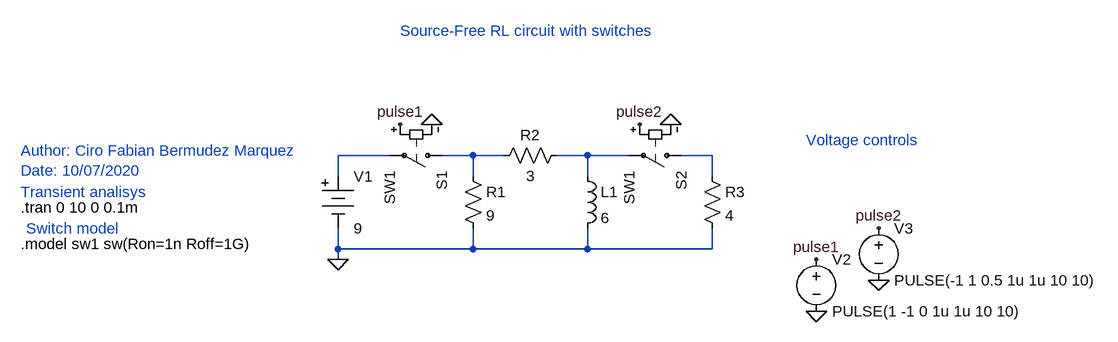
[diagram p0: schematic source_free_RL_with_switches.asc]
source_free_RL_with_switches.asc, the LTspice schematic file:
Version 4
SHEET 1 1204 680
WIRE -96 224 -176 224
WIRE 32 224 -16 224
WIRE 80 224 32 224
WIRE 208 224 160 224
WIRE 272 224 208 224
WIRE 400 224 352 224
WIRE -176 256 -176 224
WIRE 32 256 32 224
WIRE 208 256 208 224
WIRE 400 256 400 224
WIRE -176 368 -176 336
WIRE 32 368 32 336
WIRE 32 368 -176 368
WIRE 208 368 208 336
WIRE 208 368 32 368
WIRE 400 368 400 336
WIRE 400 368 208 368
WIRE -176 384 -176 368
FLAG -176 384 0
FLAG 560 464 0
FLAG 560 384 pulse1
FLAG -32 176 0
FLAG -80 176 pulse1
FLAG 336 176 0
FLAG 656 416 0
FLAG 656 336 pulse2
FLAG 288 176 pulse2
SYMBOL Misc\\battery -176 240 R0
WINDOW 123 0 0 Left 0
WINDOW 39 0 0 Left 0
SYMATTR InstName V1
SYMATTR Value 9
SYMBOL res 64 240 R270
WINDOW 0 32 56 VTop 2
WINDOW 3 0 56 VBottom 2
SYMATTR InstName R2
SYMATTR Value 3
SYMBOL res 16 240 R0
SYMATTR InstName R1
SYMATTR Value 9
SYMBOL res 384 240 R0
SYMATTR InstName R3
SYMATTR Value 4
SYMBOL ind 192 240 R0
SYMATTR InstName L1
SYMATTR Value 6
SYMBOL voltage 560 368 R0
WINDOW 123 0 0 Left 0
WINDOW 39 0 0 Left 0
SYMATTR InstName V2
SYMATTR Value PULSE(1 -1 0 1u 1u 10 10)
SYMBOL sw 0 224 R90
SYMATTR InstName S1
SYMATTR Value SW1
SYMBOL sw 368 224 R90
SYMATTR InstName S2
SYMATTR Value SW1
SYMBOL voltage 656 320 R0
WINDOW 123 0 0 Left 0
WINDOW 39 0 0 Left 0
SYMATTR InstName V3
SYMATTR Value PULSE(-1 1 0.5 1u 1u 10 10)
TEXT -664 304 Left 2 !.tran 0 10 0 0.1m
TEXT -80 32 Left 2 ;Source-Free RL circuit with switches
TEXT -664 280 Left 2 ;Transient analisys
TEXT -664 216 Left 2 ;Author: Ciro Fabian Bermudez Marquez\nDate: 10/07/2020
TEXT -664 360 Left 2 !.model sw1 sw(Ron=1n Roff=1G)
TEXT -656 336 Left 2 ;Switch model
TEXT 544 200 Left 2 ;Voltage controls

The netlist it stands for:
* source_free_RL_with_switches.asc
V1 N001 0 9
R2 N002 N003 3
R1 N002 0 9
R3 N004 0 4
L1 N003 0 6
V2 pulse1 0 PULSE(1 -1 0 1u 1u 10 10)
S1 N002 N001 pulse1 0 SW1
S2 N004 N003 pulse2 0 SW1
V3 pulse2 0 PULSE(-1 1 0.5 1u 1u 10 10)
.tran 0 10 0 0.1m
* Source-Free RL circuit with switches
* Transient analisys
* Author: Ciro Fabian Bermudez Marquez
* Date: 10/07/2020
.model sw1 sw(Ron=1n Roff=1G)
* Switch model
* Voltage controls
.backanno
.end